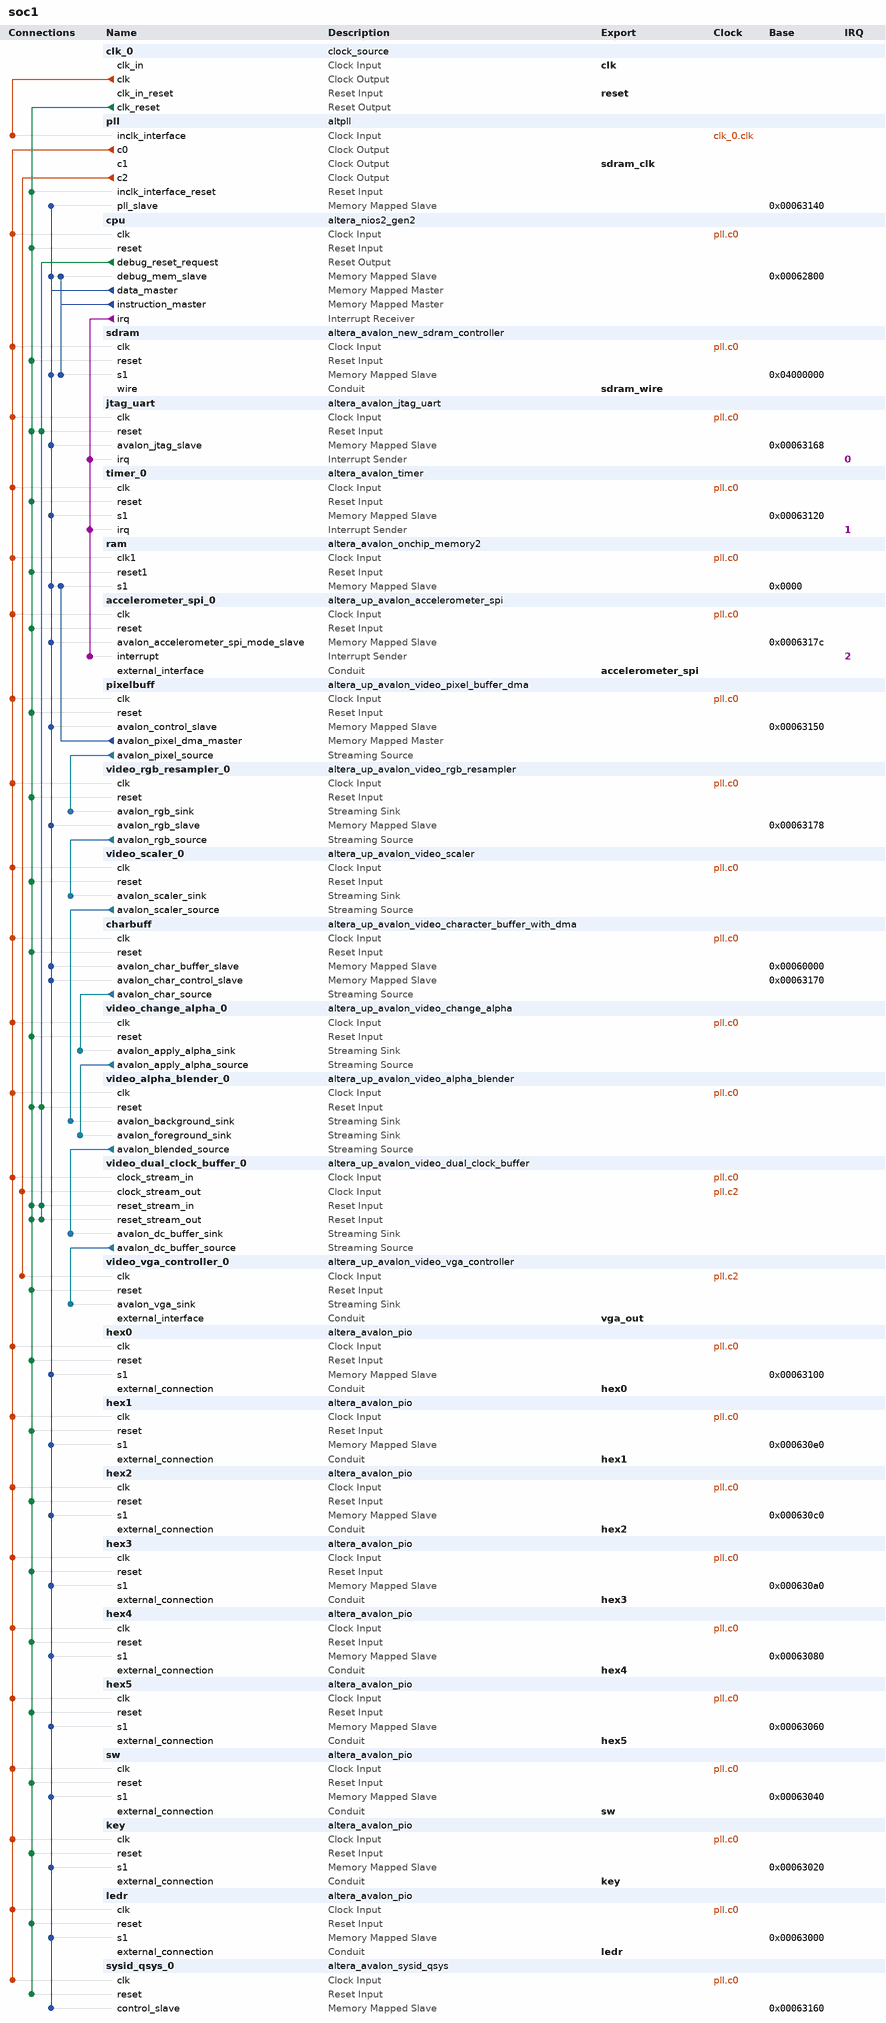
[diagram p0: system contents]
# Platform Designer (Qsys) system soc1, MAX 10 10M50DAF484C6GES
# Parameters at their usual value, and those the tool derives, are not listed.
package require -exact qsys 18.1
create_system soc1
set_project_property DEVICE_FAMILY {MAX 10}
set_project_property DEVICE 10M50DAF484C6GES

add_instance clk_0 clock_source 18.1
set_instance_parameter_value clk_0 clockFrequency 50000000

add_instance pll altpll 18.1
set_instance_parameter_value pll CLK0_DIVIDE_BY 1
set_instance_parameter_value pll CLK0_MULTIPLY_BY 1
set_instance_parameter_value pll CLK1_DIVIDE_BY 1
set_instance_parameter_value pll CLK1_DUTY_CYCLE 50
set_instance_parameter_value pll CLK1_MULTIPLY_BY 1
set_instance_parameter_value pll CLK1_PHASE_SHIFT -3000
set_instance_parameter_value pll CLK2_DIVIDE_BY 2
set_instance_parameter_value pll CLK2_DUTY_CYCLE 50
set_instance_parameter_value pll CLK2_MULTIPLY_BY 1
set_instance_parameter_value pll CLK2_PHASE_SHIFT 0
set_instance_parameter_value pll INCLK0_INPUT_FREQUENCY 20000
set_instance_parameter_value pll PORT_ARESET PORT_UNUSED
set_instance_parameter_value pll PORT_LOCKED PORT_UNUSED
set_instance_parameter_value pll PORT_clk1 PORT_USED
set_instance_parameter_value pll PORT_clk2 PORT_USED
set_instance_parameter_value pll PORT_clk3 PORT_UNUSED

add_instance cpu altera_nios2_gen2 18.1
set_instance_parameter_value cpu dcache_size 4096
set_instance_parameter_value cpu dividerType srt2
set_instance_parameter_value cpu exceptionSlave sdram.s1
set_instance_parameter_value cpu icache_size 8192
set_instance_parameter_value cpu impl Fast
set_instance_parameter_value cpu resetSlave sdram.s1

add_instance sdram altera_avalon_new_sdram_controller 18.1
set_instance_parameter_value sdram TAC 5.5
set_instance_parameter_value sdram TRCD 20.0
set_instance_parameter_value sdram TRP 20.0
set_instance_parameter_value sdram casLatency 3
set_instance_parameter_value sdram columnWidth 10
set_instance_parameter_value sdram dataWidth 16
set_instance_parameter_value sdram generateSimulationModel false
set_instance_parameter_value sdram model single_Micron_MT48LC4M32B2_7_chip
set_instance_parameter_value sdram numberOfBanks 4
set_instance_parameter_value sdram numberOfChipSelects 1
set_instance_parameter_value sdram powerUpDelay 100.0
set_instance_parameter_value sdram refreshPeriod 7.8125
set_instance_parameter_value sdram rowWidth 13

add_instance jtag_uart altera_avalon_jtag_uart 18.1
set_instance_parameter_value jtag_uart simInteractiveOptions NO_INTERACTIVE_WINDOWS

add_instance timer_0 altera_avalon_timer 18.1
set_instance_parameter_value timer_0 period 1
set_instance_parameter_value timer_0 periodUnits MSEC

add_instance ram altera_avalon_onchip_memory2 18.1
set_instance_parameter_value ram blockType M9K
set_instance_parameter_value ram dataWidth 32
set_instance_parameter_value ram dualPort false
set_instance_parameter_value ram initMemContent false
set_instance_parameter_value ram initializationFileName onchip_mem.hex
set_instance_parameter_value ram memorySize 100000
set_instance_parameter_value ram singleClockOperation true

add_instance accelerometer_spi_0 altera_up_avalon_accelerometer_spi 18.0

add_instance pixelbuff altera_up_avalon_video_pixel_buffer_dma 18.0
set_instance_parameter_value pixelbuff addr_mode X-Y
set_instance_parameter_value pixelbuff back_start_address 65536
set_instance_parameter_value pixelbuff color_space {8-bit RGB}
set_instance_parameter_value pixelbuff image_height 120
set_instance_parameter_value pixelbuff image_width 160
set_instance_parameter_value pixelbuff start_address 0

add_instance video_rgb_resampler_0 altera_up_avalon_video_rgb_resampler 18.0
set_instance_parameter_value video_rgb_resampler_0 alpha 1023
set_instance_parameter_value video_rgb_resampler_0 input_type {8-bit RGB}
set_instance_parameter_value video_rgb_resampler_0 output_type {30-bit RGB}

add_instance video_scaler_0 altera_up_avalon_video_scaler 18.0
set_instance_parameter_value video_scaler_0 color_bits 10
set_instance_parameter_value video_scaler_0 color_planes 3
set_instance_parameter_value video_scaler_0 height_in 120
set_instance_parameter_value video_scaler_0 height_scaling 4
set_instance_parameter_value video_scaler_0 width_in 160
set_instance_parameter_value video_scaler_0 width_scaling 4

add_instance charbuff altera_up_avalon_video_character_buffer_with_dma 18.0
set_instance_parameter_value charbuff enable_transparency true

add_instance video_change_alpha_0 altera_up_avalon_video_change_alpha 18.0
set_instance_parameter_value video_change_alpha_0 alpha 100
set_instance_parameter_value video_change_alpha_0 color 0
set_instance_parameter_value video_change_alpha_0 color_bits 10
set_instance_parameter_value video_change_alpha_0 color_planes 4

add_instance video_alpha_blender_0 altera_up_avalon_video_alpha_blender 18.0

add_instance video_dual_clock_buffer_0 altera_up_avalon_video_dual_clock_buffer 18.0
set_instance_parameter_value video_dual_clock_buffer_0 color_bits 10

add_instance video_vga_controller_0 altera_up_avalon_video_vga_controller 18.0
set_instance_parameter_value video_vga_controller_0 board DE10-Lite
set_instance_parameter_value video_vga_controller_0 resolution {VGA 640x480}

add_instance hex0 altera_avalon_pio 18.1
set_instance_parameter_value hex0 bitModifyingOutReg true
set_instance_parameter_value hex0 direction Output
set_instance_parameter_value hex0 width 4

add_instance hex1 altera_avalon_pio 18.1
set_instance_parameter_value hex1 bitModifyingOutReg true
set_instance_parameter_value hex1 direction Output
set_instance_parameter_value hex1 width 4

add_instance hex2 altera_avalon_pio 18.1
set_instance_parameter_value hex2 bitModifyingOutReg true
set_instance_parameter_value hex2 direction Output
set_instance_parameter_value hex2 width 4

add_instance hex3 altera_avalon_pio 18.1
set_instance_parameter_value hex3 bitModifyingOutReg true
set_instance_parameter_value hex3 direction Output
set_instance_parameter_value hex3 width 4

add_instance hex4 altera_avalon_pio 18.1
set_instance_parameter_value hex4 bitModifyingOutReg true
set_instance_parameter_value hex4 direction Output
set_instance_parameter_value hex4 width 4

add_instance hex5 altera_avalon_pio 18.1
set_instance_parameter_value hex5 bitModifyingOutReg true
set_instance_parameter_value hex5 direction Output
set_instance_parameter_value hex5 width 4

add_instance sw altera_avalon_pio 18.1
set_instance_parameter_value sw bitModifyingOutReg true
set_instance_parameter_value sw direction Input
set_instance_parameter_value sw width 10

add_instance key altera_avalon_pio 18.1
set_instance_parameter_value key bitModifyingOutReg true
set_instance_parameter_value key direction Input
set_instance_parameter_value key width 2

add_instance ledr altera_avalon_pio 18.1
set_instance_parameter_value ledr bitModifyingOutReg true
set_instance_parameter_value ledr direction Output
set_instance_parameter_value ledr width 10

add_instance sysid_qsys_0 altera_avalon_sysid_qsys 18.1
set_instance_parameter_value sysid_qsys_0 id 1

# connections
add_connection clk_0.clk pll.inclk_interface clock
add_connection pll.c0 accelerometer_spi_0.clk clock
add_connection pll.c0 charbuff.clk clock
add_connection pll.c0 cpu.clk clock
add_connection pll.c0 hex0.clk clock
add_connection pll.c0 hex1.clk clock
add_connection pll.c0 hex2.clk clock
add_connection pll.c0 hex3.clk clock
add_connection pll.c0 hex4.clk clock
add_connection pll.c0 hex5.clk clock
add_connection pll.c0 jtag_uart.clk clock
add_connection pll.c0 key.clk clock
add_connection pll.c0 ledr.clk clock
add_connection pll.c0 pixelbuff.clk clock
add_connection pll.c0 ram.clk1 clock
add_connection pll.c0 sdram.clk clock
add_connection pll.c0 sw.clk clock
add_connection pll.c0 sysid_qsys_0.clk clock
add_connection pll.c0 timer_0.clk clock
add_connection pll.c0 video_alpha_blender_0.clk clock
add_connection pll.c0 video_change_alpha_0.clk clock
add_connection pll.c0 video_dual_clock_buffer_0.clock_stream_in clock
add_connection pll.c0 video_rgb_resampler_0.clk clock
add_connection pll.c0 video_scaler_0.clk clock
add_connection pll.c2 video_dual_clock_buffer_0.clock_stream_out clock
add_connection pll.c2 video_vga_controller_0.clk clock
add_connection clk_0.clk_reset accelerometer_spi_0.reset reset
add_connection clk_0.clk_reset charbuff.reset reset
add_connection clk_0.clk_reset cpu.reset reset
add_connection clk_0.clk_reset hex0.reset reset
add_connection clk_0.clk_reset hex1.reset reset
add_connection clk_0.clk_reset hex2.reset reset
add_connection clk_0.clk_reset hex3.reset reset
add_connection clk_0.clk_reset hex4.reset reset
add_connection clk_0.clk_reset hex5.reset reset
add_connection clk_0.clk_reset jtag_uart.reset reset
add_connection clk_0.clk_reset key.reset reset
add_connection clk_0.clk_reset ledr.reset reset
add_connection clk_0.clk_reset pixelbuff.reset reset
add_connection clk_0.clk_reset pll.inclk_interface_reset reset
add_connection clk_0.clk_reset ram.reset1 reset
add_connection clk_0.clk_reset sdram.reset reset
add_connection clk_0.clk_reset sw.reset reset
add_connection clk_0.clk_reset sysid_qsys_0.reset reset
add_connection clk_0.clk_reset timer_0.reset reset
add_connection clk_0.clk_reset video_alpha_blender_0.reset reset
add_connection clk_0.clk_reset video_change_alpha_0.reset reset
add_connection clk_0.clk_reset video_dual_clock_buffer_0.reset_stream_in reset
add_connection clk_0.clk_reset video_dual_clock_buffer_0.reset_stream_out reset
add_connection clk_0.clk_reset video_rgb_resampler_0.reset reset
add_connection clk_0.clk_reset video_scaler_0.reset reset
add_connection clk_0.clk_reset video_vga_controller_0.reset reset
add_connection cpu.debug_reset_request jtag_uart.reset reset
add_connection cpu.debug_reset_request video_alpha_blender_0.reset reset
add_connection cpu.debug_reset_request video_dual_clock_buffer_0.reset_stream_in reset
add_connection cpu.debug_reset_request video_dual_clock_buffer_0.reset_stream_out reset
add_connection cpu.data_master accelerometer_spi_0.avalon_accelerometer_spi_mode_slave avalon
set_connection_parameter_value cpu.data_master/accelerometer_spi_0.avalon_accelerometer_spi_mode_slave baseAddress 0x0006317c
add_connection cpu.data_master charbuff.avalon_char_buffer_slave avalon
set_connection_parameter_value cpu.data_master/charbuff.avalon_char_buffer_slave baseAddress 0x00060000
add_connection cpu.data_master charbuff.avalon_char_control_slave avalon
set_connection_parameter_value cpu.data_master/charbuff.avalon_char_control_slave baseAddress 0x00063170
add_connection cpu.data_master cpu.debug_mem_slave avalon
set_connection_parameter_value cpu.data_master/cpu.debug_mem_slave baseAddress 0x00062800
add_connection cpu.data_master hex0.s1 avalon
set_connection_parameter_value cpu.data_master/hex0.s1 baseAddress 0x00063100
add_connection cpu.data_master hex1.s1 avalon
set_connection_parameter_value cpu.data_master/hex1.s1 baseAddress 0x000630e0
add_connection cpu.data_master hex2.s1 avalon
set_connection_parameter_value cpu.data_master/hex2.s1 baseAddress 0x000630c0
add_connection cpu.data_master hex3.s1 avalon
set_connection_parameter_value cpu.data_master/hex3.s1 baseAddress 0x000630a0
add_connection cpu.data_master hex4.s1 avalon
set_connection_parameter_value cpu.data_master/hex4.s1 baseAddress 0x00063080
add_connection cpu.data_master hex5.s1 avalon
set_connection_parameter_value cpu.data_master/hex5.s1 baseAddress 0x00063060
add_connection cpu.data_master jtag_uart.avalon_jtag_slave avalon
set_connection_parameter_value cpu.data_master/jtag_uart.avalon_jtag_slave baseAddress 0x00063168
add_connection cpu.data_master key.s1 avalon
set_connection_parameter_value cpu.data_master/key.s1 baseAddress 0x00063020
add_connection cpu.data_master ledr.s1 avalon
set_connection_parameter_value cpu.data_master/ledr.s1 baseAddress 0x00063000
add_connection cpu.data_master pixelbuff.avalon_control_slave avalon
set_connection_parameter_value cpu.data_master/pixelbuff.avalon_control_slave baseAddress 0x00063150
add_connection cpu.data_master pll.pll_slave avalon
set_connection_parameter_value cpu.data_master/pll.pll_slave baseAddress 0x00063140
add_connection cpu.data_master ram.s1 avalon
set_connection_parameter_value cpu.data_master/ram.s1 baseAddress 0x0000
add_connection cpu.data_master sdram.s1 avalon
set_connection_parameter_value cpu.data_master/sdram.s1 baseAddress 0x04000000
add_connection cpu.data_master sw.s1 avalon
set_connection_parameter_value cpu.data_master/sw.s1 baseAddress 0x00063040
add_connection cpu.data_master sysid_qsys_0.control_slave avalon
set_connection_parameter_value cpu.data_master/sysid_qsys_0.control_slave baseAddress 0x00063160
add_connection cpu.data_master timer_0.s1 avalon
set_connection_parameter_value cpu.data_master/timer_0.s1 baseAddress 0x00063120
add_connection cpu.data_master video_rgb_resampler_0.avalon_rgb_slave avalon
set_connection_parameter_value cpu.data_master/video_rgb_resampler_0.avalon_rgb_slave baseAddress 0x00063178
add_connection cpu.instruction_master cpu.debug_mem_slave avalon
set_connection_parameter_value cpu.instruction_master/cpu.debug_mem_slave baseAddress 0x00062800
add_connection cpu.instruction_master sdram.s1 avalon
set_connection_parameter_value cpu.instruction_master/sdram.s1 baseAddress 0x04000000
add_connection pixelbuff.avalon_pixel_dma_master ram.s1 avalon
set_connection_parameter_value pixelbuff.avalon_pixel_dma_master/ram.s1 baseAddress 0x0000
add_connection charbuff.avalon_char_source video_change_alpha_0.avalon_apply_alpha_sink avalon_streaming
add_connection pixelbuff.avalon_pixel_source video_rgb_resampler_0.avalon_rgb_sink avalon_streaming
add_connection video_alpha_blender_0.avalon_blended_source video_dual_clock_buffer_0.avalon_dc_buffer_sink avalon_streaming
add_connection video_change_alpha_0.avalon_apply_alpha_source video_alpha_blender_0.avalon_foreground_sink avalon_streaming
add_connection video_dual_clock_buffer_0.avalon_dc_buffer_source video_vga_controller_0.avalon_vga_sink avalon_streaming
add_connection video_rgb_resampler_0.avalon_rgb_source video_scaler_0.avalon_scaler_sink avalon_streaming
add_connection video_scaler_0.avalon_scaler_source video_alpha_blender_0.avalon_background_sink avalon_streaming
add_connection cpu.irq accelerometer_spi_0.interrupt interrupt
set_connection_parameter_value cpu.irq/accelerometer_spi_0.interrupt irqNumber 2
add_connection cpu.irq jtag_uart.irq interrupt
set_connection_parameter_value cpu.irq/jtag_uart.irq irqNumber 0
add_connection cpu.irq timer_0.irq interrupt
set_connection_parameter_value cpu.irq/timer_0.irq irqNumber 1

# exported interfaces
add_interface accelerometer_spi conduit end
set_interface_property accelerometer_spi EXPORT_OF accelerometer_spi_0.external_interface
add_interface clk clock sink
set_interface_property clk EXPORT_OF clk_0.clk_in
add_interface hex0 conduit end
set_interface_property hex0 EXPORT_OF hex0.external_connection
add_interface hex1 conduit end
set_interface_property hex1 EXPORT_OF hex1.external_connection
add_interface hex2 conduit end
set_interface_property hex2 EXPORT_OF hex2.external_connection
add_interface hex3 conduit end
set_interface_property hex3 EXPORT_OF hex3.external_connection
add_interface hex4 conduit end
set_interface_property hex4 EXPORT_OF hex4.external_connection
add_interface hex5 conduit end
set_interface_property hex5 EXPORT_OF hex5.external_connection
add_interface key conduit end
set_interface_property key EXPORT_OF key.external_connection
add_interface ledr conduit end
set_interface_property ledr EXPORT_OF ledr.external_connection
add_interface reset reset sink
set_interface_property reset EXPORT_OF clk_0.clk_in_reset
add_interface sdram_clk clock source
set_interface_property sdram_clk EXPORT_OF pll.c1
add_interface sdram_wire conduit end
set_interface_property sdram_wire EXPORT_OF sdram.wire
add_interface sw conduit end
set_interface_property sw EXPORT_OF sw.external_connection
add_interface vga_out conduit end
set_interface_property vga_out EXPORT_OF video_vga_controller_0.external_interface

set_interconnect_requirement {$system} qsys_mm.clockCrossingAdapter HANDSHAKE
set_interconnect_requirement {$system} qsys_mm.enableEccProtection FALSE
set_interconnect_requirement {$system} qsys_mm.insertDefaultSlave FALSE
set_interconnect_requirement {$system} qsys_mm.maxAdditionalLatency 1

save_system soc1.qsys
